# Altium schematic sheet bender_isometer_interface.SchDoc: foxBMS BMS-Master
size A3; DocumentNumber: 13; SheetNumber: 13; SheetTotal: 24; Author: Fraunhofer IISB foxBMS Team; REL-DATE: 2017-05-16; VERSION: 1.0.2; SheetDescription: Bender Isometer Interface
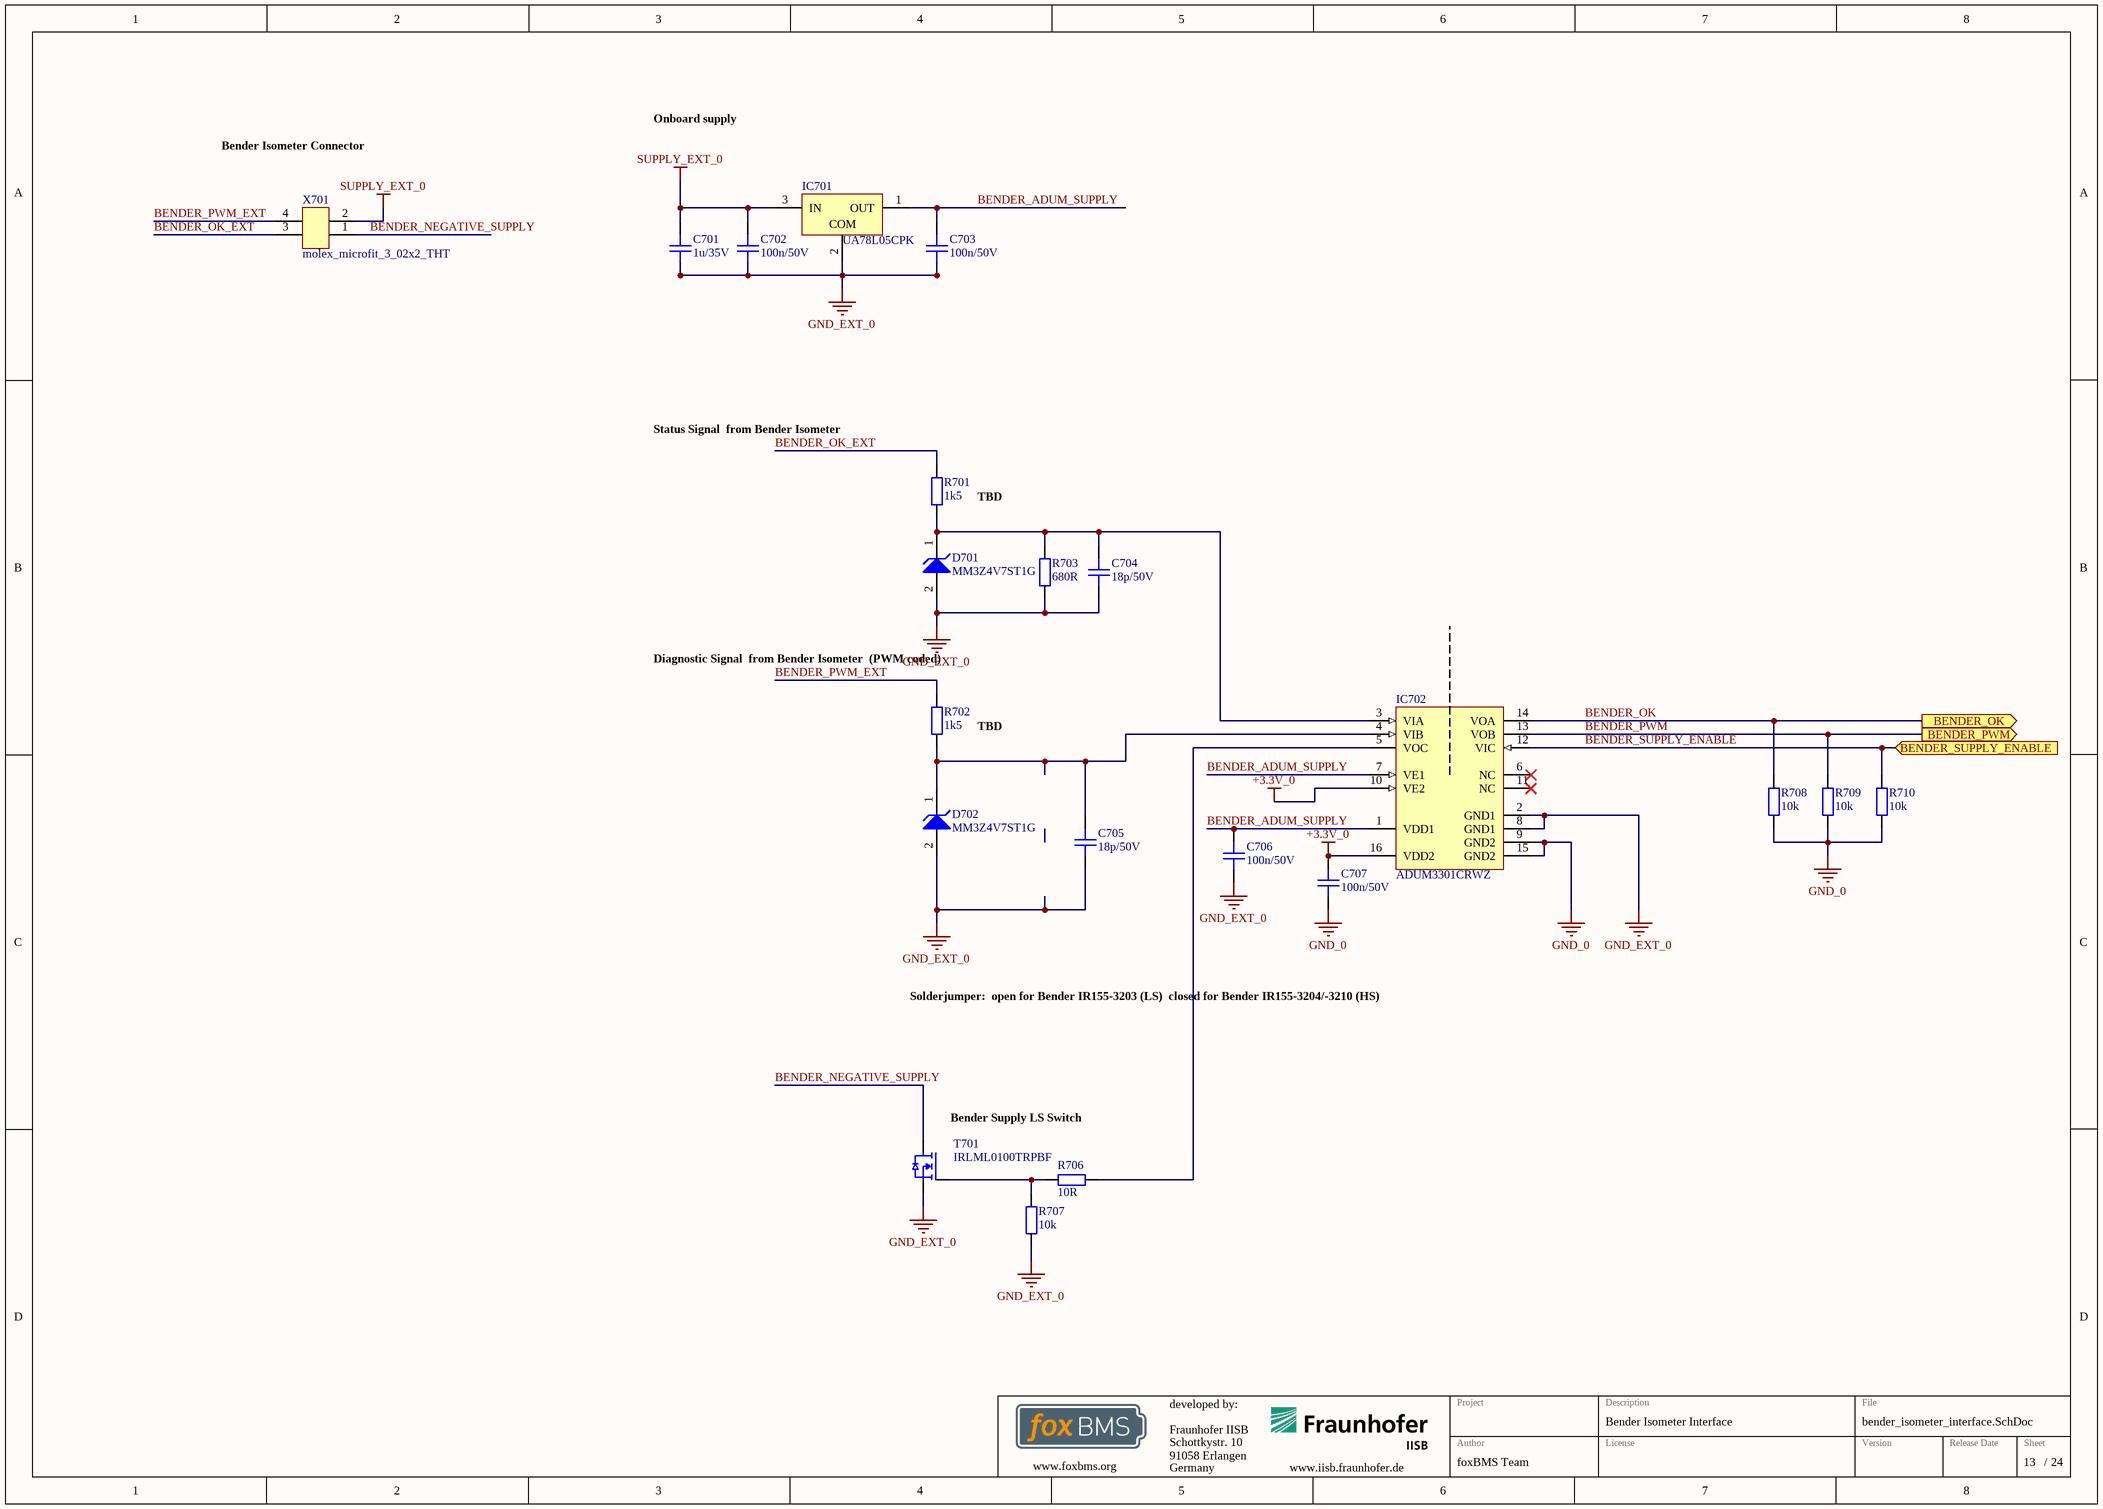
[diagram p0: bender_isometer_interface.SchDoc]

## Parts
C701  1u/35V  [CAPC1608X08N]
C702  100n/50V  [CAPC1608X08N]
C703  100n/50V  [CAPC1608X08N]
C704  18p/50V  [CAPC1608X08N]
C705  18p/50V  [CAPC1608X08N]
C706  100n/50V  [CAPC1608X08N]
C707  100n/50V  [CAPC1608X08N]
D701  MM3Z4V7ST1G  [ONSC-SOD-323-2-477-02_V]
D702  MM3Z4V7ST1G  [ONSC-SOD-323-2-477-02_V]
IC701  UA78L05CPK  [PK0003A_L]
IC702  ADUM3301CRWZ  [ADI-RW-16_N]
R701  1k5  [RESC1608X05N]
R702  1k5  [RESC1608X05N]
R703  680R  [RESC1608X05N]
R706  10R  [RESC1608X05N]
R707  10k  [RESC1608X05N]
R708  10k  [RESC1608X05N]
R709  10k  [RESC1608X05N]
R710  10k  [RESC1608X05N]
T701  IRLML0100TRPBF  [SOT95P237X110-3N]
X701  molex_microfit_3_02x2_THT  [MOLEX_MICROFIT_02x2_THT]

## Ports
BENDER_OK (out), BENDER_PWM (out), BENDER_SUPPLY_ENABLE (in)

## Nets
+3.3V_0: C707.1 IC702.10(VE2) IC702.16(VDD2)
GND_0: C707.2 IC702.9(GND2) IC702.15(GND2) R708.1 R709.1 R710.1
GND_EXT_0: C701.2 C702.2 C703.2 C704.2 C705.2 C706.2 D701.2(A) D702.2(A) IC701.2(COM) IC702.2(GND1) IC702.8(GND1) R703.1 R707.2 T701.S
SUPPLY_EXT_0: C701.1 C702.1 IC701.3(IN) X701.2
BENDER_ADUM_SUPPLY: C703.1 C706.1 IC701.1(OUT) IC702.1(VDD1) IC702.7(VE1)
BENDER_NEGATIVE_SUPPLY: T701.D X701.1
BENDER_OK: IC702.14(VOA) R708.2 ; port BENDER_OK
BENDER_OK_EXT: R701.2 X701.3
BENDER_PWM: IC702.13(VOB) R709.2 ; port BENDER_PWM
BENDER_PWM_EXT: R702.2 X701.4
BENDER_SUPPLY_ENABLE: IC702.12(VIC) R710.2 ; port BENDER_SUPPLY_ENABLE
NetC704_1: C704.1 D701.1(K) IC702.3(VIA) R701.1 R703.2
NetC705_1: C705.1 D702.1(K) IC702.4(VIB) R702.1
NetIC702_5: IC702.5(VOC) R706.1
NetR706_2: R706.2 R707.1 T701.G

Not connected (* = marked no-connect by the designer): IC702 6(NC)* 11(NC)*

## Notes on the sheet
- Bender Isometer Connector
- Onboard supply
- Status Signal
  from Bender Isometer
- (near R701) TBD
- (near R702) Diagnostic Signal
  from Bender Isometer
  (PWM coded)
- (near R702) TBD
- Solderjumper:
  open for Bender IR155-3203 (LS)
  closed for Bender IR155-3204/-3210 (HS)
- (near T701) Bender Supply LS Switch
- Fraunhofer IISB
- Schottkystr. 10
- developed by:
- 91058 Erlangen
- Germany
- Author
- Project
- License
- Description
- File
- Version
- Release Date
- Sheet
- www.foxbms.org
- www.iisb.fraunhofer.de
- foxBMS Team
- /

## Library data of the parts
C701 = gen_C_ceramic_1u_35V_X7R_0603: MLCC; Capacitance: 1u; Rated Voltage: 35V; Dielectric: X7R; Case EIA: 0603; Case Metric: 1608; PnP Package: C_0603_10; PnP Value: 1uF/35V/X7R; PnP equipped: x; Automotive Qualified: False; Part Number: gen_C_ceramic_1u_35V_X7R_0603; Supplier 1: Farnell; Supplier Part Number 1: 1907508
C702 C703 C706 C707 = gen_C_ceramic_100n_50V_X7R_0603: MLCC; Capacitance: 100n; Rated Voltage: 50V; Dielectric: X7R; Case EIA: 0603; Case Metric: 1608; PnP Package: C_0603_10; PnP Value: 100n/50V/X7R; PnP equipped: x; Automotive Qualified: False; Part Number: gen_C_ceramic_100n_50V_X7R_0603; Supplier 1: Farnell; Supplier Part Number 1: 2525267; Supplier 2: Digikey; Supplier Part Number 2: 490-6049-1-ND
C704 C705 = gen_C_ceramic_18p_50V_C0G_0603: MLCC; Capacitance: 18p; Rated Voltage: 50V; Dielectric: C0G; Case EIA: 0603; Case Metric: 1608; Automotive Qualified: False; Part Number: gen_C_ceramic_18p_50V_C0G_0603; Supplier 1: Farnell; Supplier Part Number 1: 2070403
D701 D702 = CMP-1060-00697-1: Zener Voltage Regulator, 300 mW, Tight Tolerance Portfolio, 2-Pin SOD-323, Pb-Free, Tape and Reel; Manufacturer: On Semiconductor; P Max (W): 0.3; ComponentLink2Description: Datasheet; PackageDescription: 2-Pin SOD, Body 1.7 x 1.25 mm; PartNumber: MM3Z4V7ST1G; ComponentLink2URL: http://www.onsemi.cn/pub_link/Collateral/MM3Z2V4ST1-D.PDF; ComponentLink1Description: Manufacturer URL; DatasheetVersion: Rev. 21; PackageReference: SOD-323-2-477-02; ComponentLink3URL: http://www.onsemi.com/pub_link/Collateral/477-02.PDF.1; RoHS: Pb-Free; ComponentLink3Description: Package Specification; ComponentLink1URL: http://www.onsemi.com/; Packing: Tape and Reel; Mounting Technology: Surface Mount; PackageVersion: Rev. H, 03/2007
IC701 = CMP-2000-07341-1: Positive-Voltage Regulator, 100 mA, 0 to 125 degC, 3-Pin SOT-89 (PK), Green (RoHS & no Sb/Br), Tape and Reel; Manufacturer: TexasInstruments; Load Regulation: 60mV; Input Voltage MIN: 7V; Number of Outputs: 1; Input Voltage MAX: 20V; Output Type: Fixed; Output Current: 100mA; Output Voltage: 5V; PSRR / Ripple Rejection - Typ: 49dB; Line Regulation: 200mV; Mounting Style: SMD/SMT; Datasheet Version: Rev. U, 05/2011; Polarity: Positive; Minimum Operating Temperature: 0C; Package Reference: PK0003A; Brand: TexasInstruments; Packaging: Reel; Product Category: LinearVoltageRegulators; RoHS: True; Datasheet URL: http://www.ti.com/lit/ds/symlink/ua78l05.pdf; Package URL: http://www.ti.com/lit/ml/mhsi001b/mhsi001b.pdf; Series: UA78L05; Manufacturer URL: http://www.ti.com/; Package Description: 3-Pin Small Outline Transistor, Body 4.5 x 2.5 mm, Pitch 1.5 mm; Mounting Technology: SurfaceMount; Package / Case: SOT-89-4; Maximum Operating Temperature: +125C
IC702 = CMP-0534-00610-1: Triple Channel Digital Isolator, Enhanced System-Level ESD Reliability, 2.5 KV rms Insulation Rating, 90 Mbps Data Rate, 32 ns Delay, Industrial, 16-pin SOIC (RW-16), Tube; Manufacturer: Analog Devices; Insulation Rating (kVrms): 2.5; Max Data Rate: 90Mbps; PackageVersion: 032707-B, 03/2007; PartNumber: ADUM3301CRWZ; PackageDescription: 16-Pin Standard Small Outline Package, Body 10.3 x 7.5 mm, Pitch 1.27 mm; Max Operating Temp (degreesC): 105; PackageReference: RW-16; Code_JEDEC: MS-013-AA; ComponentLink1URL: http://www.analog.com/en/index.html; ComponentLink2URL: http://www.analog.com/static/imported-files/data_sheets/ADUM3300_3301.pdf; ComponentLink1Description: Manufacturer URL; ComponentLink4URL: Product URL:http://www.analog.com/en/interface-isolation/digital-isolators/adum3301/products/product.html; ComponentLink4Description: URL Link1; DatasheetVersion: Rev. B; ComponentLink3URL: http://www.analog.com/static/imported-files/packages/PKG_PDF/SOIC_WIDE%20%28RW%29/RW_16.pdf; ComponentLink3Description: Package Specification; Mounting Technology: Surface Mount; ComponentLink2Description: Datasheet
R701 R702 = gen_R_1k5_0603: SMD Resistor 1k5 0603; Tolerance: 1%; Power: 0.1W; Case EIA: 0603; Case Metric: 1608; Maximum Working Voltage: 75V; PnP Package: R_0603; Automotive Qualified: False; Part Number: gen_R_1k5_0603; Operating Temperature: -55°C - +155°C; Resistance: 1k5; Series: E24, E96; PnP Value: 1k5; Supplier 1: Farnell; Supplier Part Number 1: 2616745
R703 = gen_R_680R_0603: SMD Resistor 680R 0603; Tolerance: 1%; Power: 0.1W; Case EIA: 0603; Case Metric: 1608; Maximum Working Voltage: 75V; PnP Package: R_0603; Automotive Qualified: False; Part Number: gen_R_680R_0603; Operating Temperature: -55°C - +155°C; Resistance: 680R; Series: E24; PnP Value: 680R; Supplier 1: Farnell; Supplier Part Number 1: 2797303
R706 = gen_R_10R_0603: SMD Resistor 10R 0603; Tolerance: 1%; Power: 0.1W; Case EIA: 0603; Case Metric: 1608; Maximum Working Voltage: 75V; PnP Package: R_0603; Automotive Qualified: False; Part Number: gen_R_10R_0603; Operating Temperature: -55°C - +155°C; Resistance: 10R; Series: E24, E96; PnP Value: 10R; Supplier 1: Farnell; Supplier Part Number 1: 2073361
R707-R710 = gen_R_10k_0603: SMD Resistor 10k 0603; Tolerance: 1%; Power: 0.1W; Case EIA: 0603; Case Metric: 1608; Maximum Working Voltage: 75V; PnP Package: R_0603; Automotive Qualified: False; Part Number: gen_R_10k_0603; Operating Temperature: -55°C - +155°C; Resistance: 10k; Series: E24, E96; PnP Value: 10k; Supplier 1: Farnell; Supplier Part Number 1: 2073349
T701 = IRLML0100TRPBF: MOSFET-Transistor, n-Kanal, 1.6 A, 100 V, 0.178 ohm, 10 V, 2.5 V; Manufacturer: Infineon; Maximum Drain-Source Voltage: 100V; Maximum Continous Drain Current (25°C): 1.6A; R_DS(on): 190m; Total Gate Charge: 2.5nC; Automotive Qualified: False; Part Number: IRLML0100TRPBF; Part Name: NMOS; Operating Temperature: -55°C - +150°C; ComponentLink1Description: Datasheet URL; ComponentLink1URL: http://www.farnell.com/datasheets/491501.pdf; Supplier 1: Farnell; Supplier Part Number 1: 1783928
X701 = molex_microfit_3_02x2_THT: Micro-Fit 3.0 Right Angle Header, 3.00mm Pitch, Dual Row, 4 Circuits, with Snap-in Plastic Peg PCB Lock, Tin, Glow Wire Capable, Black, 43045-0400; Manufacturer: Molex; Circuits: 4; Rated Voltage: 600V; Rated Current: 8.5A; Automotive Qualified: False; Part Number: molex_microfit_3_02x2_THT; Part Name: MicroFit; Operating Temperature: -40°C - +105°C; Supplier 1: Farnell; Supplier Part Number 1: 9733019